# EAGLE design Bluesaab RN52 v5.0 + 10pin (EAGLE 7.6.0)
Removed DFU switch! D3 CANNOT be a Schottky diode; needs to be a signal diode. Might as well make all diodes the same... Added 2 bypass caps to RN52 power line. Switched to SN65HVD234 for higher temp (also has Enable pin which needs pulled high). Added 10 pin connector for the daughter board Amplifier. - OTHERWISE, THE LEFT 4 COLUMNS NEED JUMPERED.
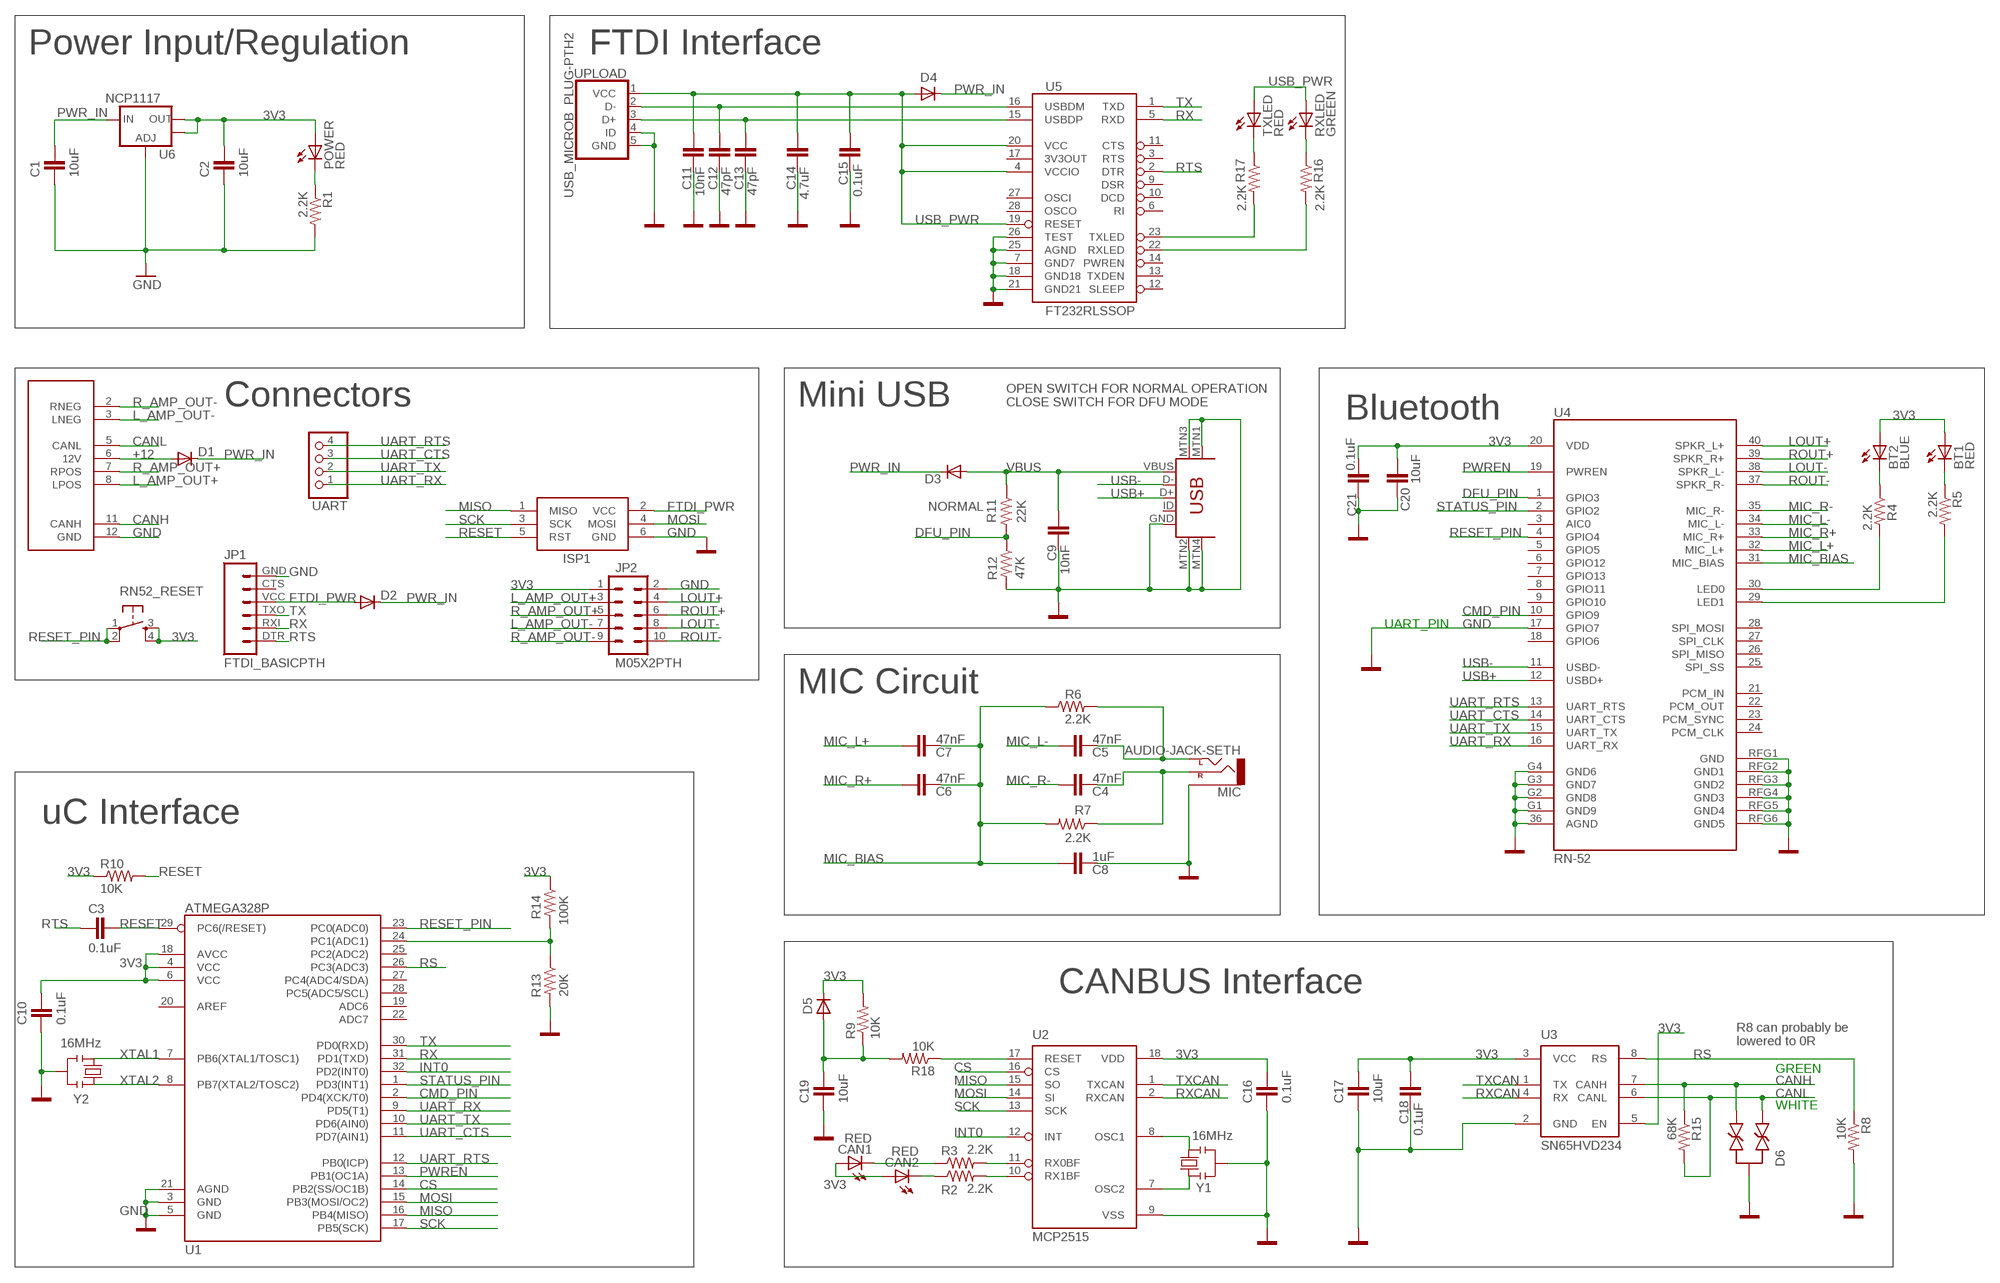
[diagram p0: schematic, sheet 1]

## Parts
BT1  RED  LEDSML1206  [SML1206]
BT2  BLUE  LEDSML1206  [SML1206]
C1  10uF  C-EUC0805K  [C0805K]
C2  10uF  C-EUC0805K  [C0805K]
C3  0.1uF  C-EUC0805K  [C0805K]
C4  47nF  C-EUC0805K  [C0805K]
C5  47nF  C-EUC0805K  [C0805K]
C6  47nF  C-EUC0805K  [C0805K]
C7  47nF  C-EUC0805K  [C0805K]
C8  1uF  C-EUC0805K  [C0805K]
C9  10nF  C-EUC0805K  [C0805K]
C10  0.1uF  C-EUC0805K  [C0805K]
C11  10nF  C-EUC0805K  [C0805K]
C12  47pF  C-EUC0805K  [C0805K]
C13  47pF  C-EUC0805K  [C0805K]
C14  4.7uF  C-EUC0805K  [C0805K]
C15  0.1uF  C-EUC0805K  [C0805K]
C16  0.1uF  C-EUC0805K  [C0805K]
C17  10uF  C-EUC0805K  [C0805K]
C18  0.1uF  C-EUC0805K  [C0805K]
C19  10uF  C-EUC0805K  [C0805K]
C20  10uF  C-EUC0805K  [C0805K]
C21  0.1uF  C-EUC0805K  [C0805K]
CAN1  RED  LEDSML1206  [SML1206]
CAN2  RED  LEDSML1206  [SML1206]
D1  DIODE-SCHOTTKY_  DIODE-SOD123  [SOD123]
D2  DIODE-SCHOTTKY_  DIODE-SOD123  [SOD123]
D3  DIODE-SCHOTTKY_  DIODE-SOD123  [SOD123]
D4  DIODE-SCHOTTKY_  DIODE-SOD123  [SOD123]
D5  DIODE-SCHOTTKY_  DIODE-SOD123  [SOD123]
D6  DIODE-ARRAY  [SOT23]
ISP1  AVRISP-6  [AVRISP]
JP1  FTDI_BASICPTH  [FTDI_BASIC]
JP2  M05X2PTH  [AVR_ICSP]
MIC  AUDIO-JACK-SETH  [AUDIO-JACK-3.5MM-SMD-SETH]
POWER  RED  LEDSML1206  [SML1206]
R1  2.2K  R-US_R0805  [R0805]
R2  2.2K  R-US_R0805  [R0805]
R3  2.2K  R-US_R0805  [R0805]
R4  2.2K  R-US_R0805  [R0805]
R5  2.2K  R-US_R0805  [R0805]
R6  2.2K  R-US_R0805  [R0805]
R7  2.2K  R-US_R0805  [R0805]
R8  10K  R-US_R0805  [R0805]
R9  10K  R-US_R0805  [R0805]
R10  10K  R-US_R0805  [R0805]
R11  22K  R-US_R0805  [R0805]
R12  47K  R-US_R0805  [R0805]
R13  20K  R-US_R0805  [R0805]
R14  100K  R-US_R0805  [R0805]
R15  68K  R-US_R0805  [R0805]
R16  2.2K  R-US_R0805  [R0805]
R17  2.2K  R-US_R0805  [R0805]
R18  10K  R-US_R0805  [R0805]
RN52_FIRMWARE  USB-MINIB-5PIN  [USB-MINIB]
RN52_RESET  TAC_SWITCH  [TACTILE_SWITCH_SMD_6MM]
RXLED  GREEN  LEDSML1206  [SML1206]
TXLED  RED  LEDSML1206  [SML1206]
U1  ATMEGA328P  ATMEGA328_SMT  [TQFP32-08]
U2  MCP2515  [SO18L]
U3  SN65HVD234  [SO8]
U4  RN-52  BLUETOOTH-RN-52  [RN-52]
U5  FT232RLSSOP  [SSOP28DB]
U6  NCP1117  V_REG_LM1117SOT223  [SOT223]
U$5  827229-1  [827229-1]
UART  PINHD-1X4  [1X04]
UPLOAD  USB_MICROB_PLUG-PTH2  [MICRO-B-TH]
Y1  16MHz  RESONATORSMD  [RESONATOR-SMD]
Y2  16MHz  RESONATORSMD  [RESONATOR-SMD]

## Nets
3V3: BT1.A BT2.A C2.2 C10.2 C16.2 C17.2 C18.1 C20.1 C21.2 CAN1.A CAN2.A D5.C JP2.1 POWER.A R9.2 R10.1 R14.1 RN52_RESET.3 RN52_RESET.4 U1.4(VCC) U1.6(VCC) U1.18(AVCC) U2.18(VDD) U3.3(VCC) U3.5(EN) U4.20(VDD) U6.2(OUT) U6.4(OUT)
+12 [12v]: D1.A U$5.6(12V)
CANH: D6.2 R15.1 U3.7(CANH) U$5.11(CANH)
CANL: D6.1 R15.2 U3.6(CANL) U$5.5(CANL)
CMD_PIN: U1.2(PD4(XCK/T0)) U4.10(GPIO9)
CS: U1.14(PB2(SS/OC1B)) U2.16(CS)
DFU_PIN: R11.2 R12.1 U4.1(GPIO3)
FTDI_PWR: D2.A ISP1.2(VCC) JP1.VCC
GND: C1.1 C2.1 C8.1 C9.1 C10.1 C11.1 C12.1 C13.1 C14.1 C15.2 C16.1 C17.1 C18.2 C19.1 C20.2 C21.1 D6.3 ISP1.6(GND) JP1.GND JP2.2 MIC.SLEEVE R1.2 R8.2 R12.2 R13.2 RN52_FIRMWARE.GND RN52_FIRMWARE.MTN1(MTN2) RN52_FIRMWARE.MTN2(MTN3) RN52_FIRMWARE.MTN3(MTN1) RN52_FIRMWARE.MTN4 U1.3(GND) U1.5(GND) U1.21(AGND) U2.9(VSS) U3.2(GND) U4.17(GPIO7) U4.36(AGND) U4.G1(GND9) U4.G2(GND8) U4.G3(GND7) U4.G4(GND6) U4.RFG1(GND) U4.RFG2(GND1) U4.RFG3(GND2) U4.RFG4(GND3) U4.RFG5(GND4) U4.RFG6(GND5) U5.7(GND7) U5.18(GND18) U5.21(GND21) U5.25(AGND) U5.26(TEST) U6.1(ADJ) U$5.12(GND) UPLOAD.4(ID) UPLOAD.5(GND) Y1.2 Y2.2
INT0: U1.32(PD2(INT0)) U2.12(INT)
L_AMP_OUT+: JP2.3 U$5.8(LPOS)
L_AMP_OUT-: JP2.7 U$5.3(LNEG)
LOUT+: JP2.4 U4.40(SPKR_L+)
LOUT-: JP2.8 U4.38(SPKR_L-)
MIC_BIAS: C6.1 C7.1 C8.2 R6.1 R7.2 U4.31(MIC_BIAS)
MIC_L+: C7.2 U4.32(MIC_L+)
MIC_L-: C5.1 U4.34(MIC_L-)
MIC_R+: C6.2 U4.33(MIC_R+)
MIC_R-: C4.1 U4.35(MIC_R-)
MISO: ISP1.1(MISO) U1.16(PB4(MISO)) U2.15(SO)
MOSI: ISP1.4(MOSI) U1.15(PB3(MOSI/OC2)) U2.14(SI)
N$1: R16.2 U5.22(RXLED)
N$4: U2.8(OSC1) Y1.3
N$5: U2.7(OSC2) Y1.1
N$6: BT2.C R4.1
N$7: BT1.C R5.1
N$8: R18.1 U2.17(RESET)
N$9: R13.1 R14.2 U1.24(PC1(ADC1))
N$10: R17.2 U5.23(TXLED)
N$12: R16.1 RXLED.C
N$13: CAN1.C R3.1
N$15: R17.1 TXLED.C
N$16: CAN2.C R2.1
N$17: POWER.C R1.1
N$18: R3.2 U2.11(RX0BF)
N$23: C4.2 MIC.RING(RIGHT) R7.1
N$25: C5.2 MIC.TIP(LEFT) R6.2
N$28: R5.2 U4.29(LED1)
N$29: R4.2 U4.30(LED0)
N$31: R2.2 U2.10(RX1BF)
N$35: C19.2 D5.A R9.1 R18.2
PWR_IN [12v]: C1.2 D1.C D2.C D3.C D4.C U6.3(IN)
PWREN: U1.13(PB1(OC1A)) U4.19(PWREN)
R_AMP_OUT+: JP2.5 U$5.7(RPOS)
R_AMP_OUT-: JP2.9 U$5.2(RNEG)
RESET: C3.2 ISP1.5(RST) R10.2 U1.29(PC6(/RESET))
RESET_PIN: RN52_RESET.1 RN52_RESET.2 U1.23(PC0(ADC0)) U4.4(GPIO4)
ROUT+: JP2.6 U4.39(SPKR_R+)
ROUT-: JP2.10 U4.37(SPKR_R-)
RS: R8.1 U1.26(PC3(ADC3)) U3.8(RS)
RTS: C3.1 JP1.DTR U5.2(DTR)
RX: JP1.RXI U1.31(PD1(TXD)) U5.5(RXD)
RXCAN: U2.2(RXCAN) U3.4(RX)
SCK: ISP1.3(SCK) U1.17(PB5(SCK)) U2.13(SCK)
STATUS_PIN: U1.1(PD3(INT1)) U4.2(GPIO2)
TX: JP1.TXO U1.30(PD0(RXD)) U5.1(TXD)
TXCAN: U2.1(TXCAN) U3.1(TX)
UART_CTS: U1.11(PD7(AIN1)) U4.14(UART_CTS) UART.3
UART_RTS: U1.12(PB0(ICP)) U4.13(UART_RTS) UART.4
UART_RX: U1.9(PD5(T1)) U4.16(UART_RX) UART.1
UART_TX: U1.10(PD6(AIN0)) U4.15(UART_TX) UART.2
USB+: RN52_FIRMWARE.D+ U4.12(USBD+)
USB-: RN52_FIRMWARE.D- U4.11(USBD-)
USB_PWR: C11.2 C14.2 C15.1 D4.A RXLED.A TXLED.A U5.4(VCCIO) U5.19(RESET) U5.20(VCC) UPLOAD.1(VCC)
USBDM: C12.2 U5.16(USBDM) UPLOAD.2(D-)
USBDP: C13.2 U5.15(USBDP) UPLOAD.3(D+)
VBUS: C9.2 D3.A R11.1 RN52_FIRMWARE.VBUS
XTAL1: U1.7(PB6(XTAL1/TOSC1)) Y2.1
XTAL2: U1.8(PB7(XTAL2/TOSC2)) Y2.3
Unconnected: JP1.CTS RN52_FIRMWARE.ID U1.19(ADC6) U1.20(AREF) U1.22(ADC7) U1.25(PC2(ADC2)) U1.27(PC4(ADC4/SDA)) U1.28(PC5(ADC5/SCL)) U4.3(AIC0) U4.5(GPIO5) U4.6(GPIO12) U4.7(GPIO13) U4.8(GPIO11) U4.9(GPIO10) U4.18(GPIO6) U4.21(PCM_IN) U4.22(PCM_OUT) U4.23(PCM_SYNC) U4.24(PCM_CLK) U4.25(SPI_SS) U4.26(SPI_MISO) U4.27(SPI_CLK) U4.28(SPI_MOSI) U5.3(RTS) U5.6(RI) U5.9(DSR) U5.10(DCD) U5.11(CTS) U5.12(SLEEP) U5.13(TXDEN) U5.14(PWREN) U5.17(3V3OUT) U5.27(OSCI) U5.28(OSCO)

## Notes on the sheet
- Power Input/Regulation | FTDI Interface
- Connectors | Mini USB
- OPEN SWITCH FOR NORMAL OPERATION
  CLOSE SWITCH FOR DFU MODE
- Bluetooth
- NORMAL
- UART_PIN
- MIC Circuit
- uC Interface
- CANBUS Interface
- R8 can probably be
  lowered to 0R
- GREEN
- WHITE

## Library data of the parts
BT1 BT2 CAN1 CAN2 POWER RXLED TXLED = led:LED: LED OSRAM: - CHIPLED LG R971, LG N971, LY N971, LG Q971, LY Q971, LO R971, LY R971 LH N974, LH R974 LS Q976, LO Q976, LY Q976 LO Q996 - Hyper CHIPLED LW Q18S LB Q993, LB Q99A, LB R99A - SideLED LS A670, LO A670, LY A670, LG A670, LP A670 LB A673, LV A673, LT A673, LW A673 LH A674 LY A675 LS A676, LA A676, LO A676, LY A676, LW A676 LS A679, LY A679, LG A679 - Hyper Micro SIDELED® LS Y876, LA Y876, LO Y876, LY Y876 LT Y87S - SmartLED LW L88C, LW L88S LB L89C, LB L89S, LG L890 LS L89K, LO L89K, LY L89K LS L896, LA L896, LO L896, LY L896 - TOPLED LS T670, LO T670, LY T670, LG T670, LP T670 LSG T670, LSP T670, LSY T670, LOP T670, LYG T670 LG T671, LOG T671, LSG T671 LB T673, LV T673, LT T673, LW T673 LH T674 LS T676, LA T676, LO T676, LY T676, LB T676, LH T676, LSB T676, LW T676 LB T67C, LV T67C, LT T67C, LS T67K, LO T67K, LY T67K, LW E67C LS E67B, LA E67B, LO E67B, LY E67B, LB E67C, LV E67C, LT E67C LW T67C LS T679, LY T679, LG T679 LS T770, LO T770, LY T770, LG T770, LP T770 LB T773, LV T773, LT T773, LW T773 LH T774 LS E675, LA E675, LY E675, LS T675 LS T776, LA T776, LO T776, LY T776, LB T776 LHGB T686 LT T68C, LB T68C - Hyper Mini TOPLED® LB M676 - Mini TOPLED Santana® LG M470 LS M47K, LO M47K, LY M47K Source: http://www.osram.convergy.de LUXEON: - LUMILED® LXK2-PW12-R00, LXK2-PW12-S00, LXK2-PW14-U00, LXK2-PW14-V00 LXK2-PM12-R00, LXK2-PM12-S00, LXK2-PM14-U00 LXK2-PE12-Q00, LXK2-PE12-R00, LXK2-PE12-S00, LXK2-PE14-T00, LXK2-PE14-U00 LXK2-PB12-K00, LXK2-PB12-L00, LXK2-PB12-M00, LXK2-PB14-N00, LXK2-PB14-P00, LXK2-PB14-Q00 LXK2-PR12-L00, LXK2-PR12-M00, LXK2-PR14-Q00, LXK2-PR14-R00 LXK2-PD12-Q00, LXK2-PD12-R00, LXK2-PD12-S00 LXK2-PH12-R00, LXK2-PH12-S00 LXK2-PL12-P00, LXK2-PL12-Q00, LXK2-PL12-R00 Source: www.luxeon.com KINGBRIGHT: KA-3528ASYC Source: www.kingbright.com
C1-C21 = rcl:C-EU: CAPACITOR, European symbol
D1-D5 = diode_seth:DIODE-: DIODE
D6 = SparkFun-seth:DIODE-ARRAY: NUP2105L, TVS Diode Array
ISP1 = adafruit:AVRISP: AVR ISP HEADER Standard 6 pin header for AVR programming
JP1 = SparkFun-seth:FTDI_BASIC: FTDI Basic: 3.3V and 5V
JP2 = SparkFun-Connectors:M05X2: Header 5x2 Standard 10-pin dual row 0.1" header. Commonly used with AVR-ISP. Use with Spark Fun Electronics SKU: PRT-00778
MIC = SparkFun-Connectors:AUDIO-JACK-SETH
R1-R18 = rcl:R-US_: RESISTOR, American symbol
RN52_FIRMWARE = SparkFun-Connectors:USB-MINIB: Mini-USB "B" connector with 5th pin broken out. Created new symbol breaking out 5th "ID" pin in mini/micro USB connector spec. See: http://en.wikipedia.org/wiki/Mini_usb#Cables. Uses same footprint as 4-pin symbol. Also added pins to connect to mounting / shield pads if required (probably not generally needed as signals aren't shielded once they leave the connector).
RN52_RESET = SparkFun-seth:TAC_SWITCH: Momentary Switch Button commonly used for reset or general input. Spark Fun Electronics SKU : COM-00097
U1 = SparkFun-DigitalIC:ATMEGA328_SMT: 32-Pin Atmega328 part Commonly used on Arduino compatible boards Available in QFP and QFN packages TQFP is IC-09069 QFN is non-stock; PROD_ID: IC-09069
U2 = mcp2515-seth:MCP2515
U3 = ti-can-seth:SN65HVD234
U4 = SparkFun-RF:BLUETOOTH-RN-52
U5 = SparkFun-DigitalIC:FT232RL: USB UART FT232RL 4th Generation USB UART (USB <-> Serial) Controller. Spark Fun Electronics SKU : COM-00650 Production SKU IC-00870; PROD_ID: IC-00870
U6 = SparkFun:V_REG_LM1117: Voltage Regulator LM1117 Standard adjustable voltage regulator but in SMD form. Spark Fun Electronics SKU : COM-00595
U$5 = 827229-1:827229-1
UART = pinhead:PINHD-1X4: PIN HEADER
UPLOAD = SparkFun-Connectors-seth:USB_MICROB_PLUG: USB Micro-B Plug Comes in a variety of packages. Check out Hirose's ZX-x0 line: http://www.hirose.co.jp/cataloge_hp/e24200011.pdf
Y1 Y2 = SparkFun-seth:RESONATOR: Resonator Small SMD resonator. This is the itty bitty 10/20MHz resonators with built in caps. CSTCE10M0G55 and CSTCE20M0V53. Footprint has been reviewed closely but hasn't been tested yet.

## Net classes
0 default: width 0.254 mm
1 12v: width 0.5 mm

## Board
New PCB design, based on v4.4, NOW with 0805 resistors and caps. Adjusted layout to account for smaller parts.
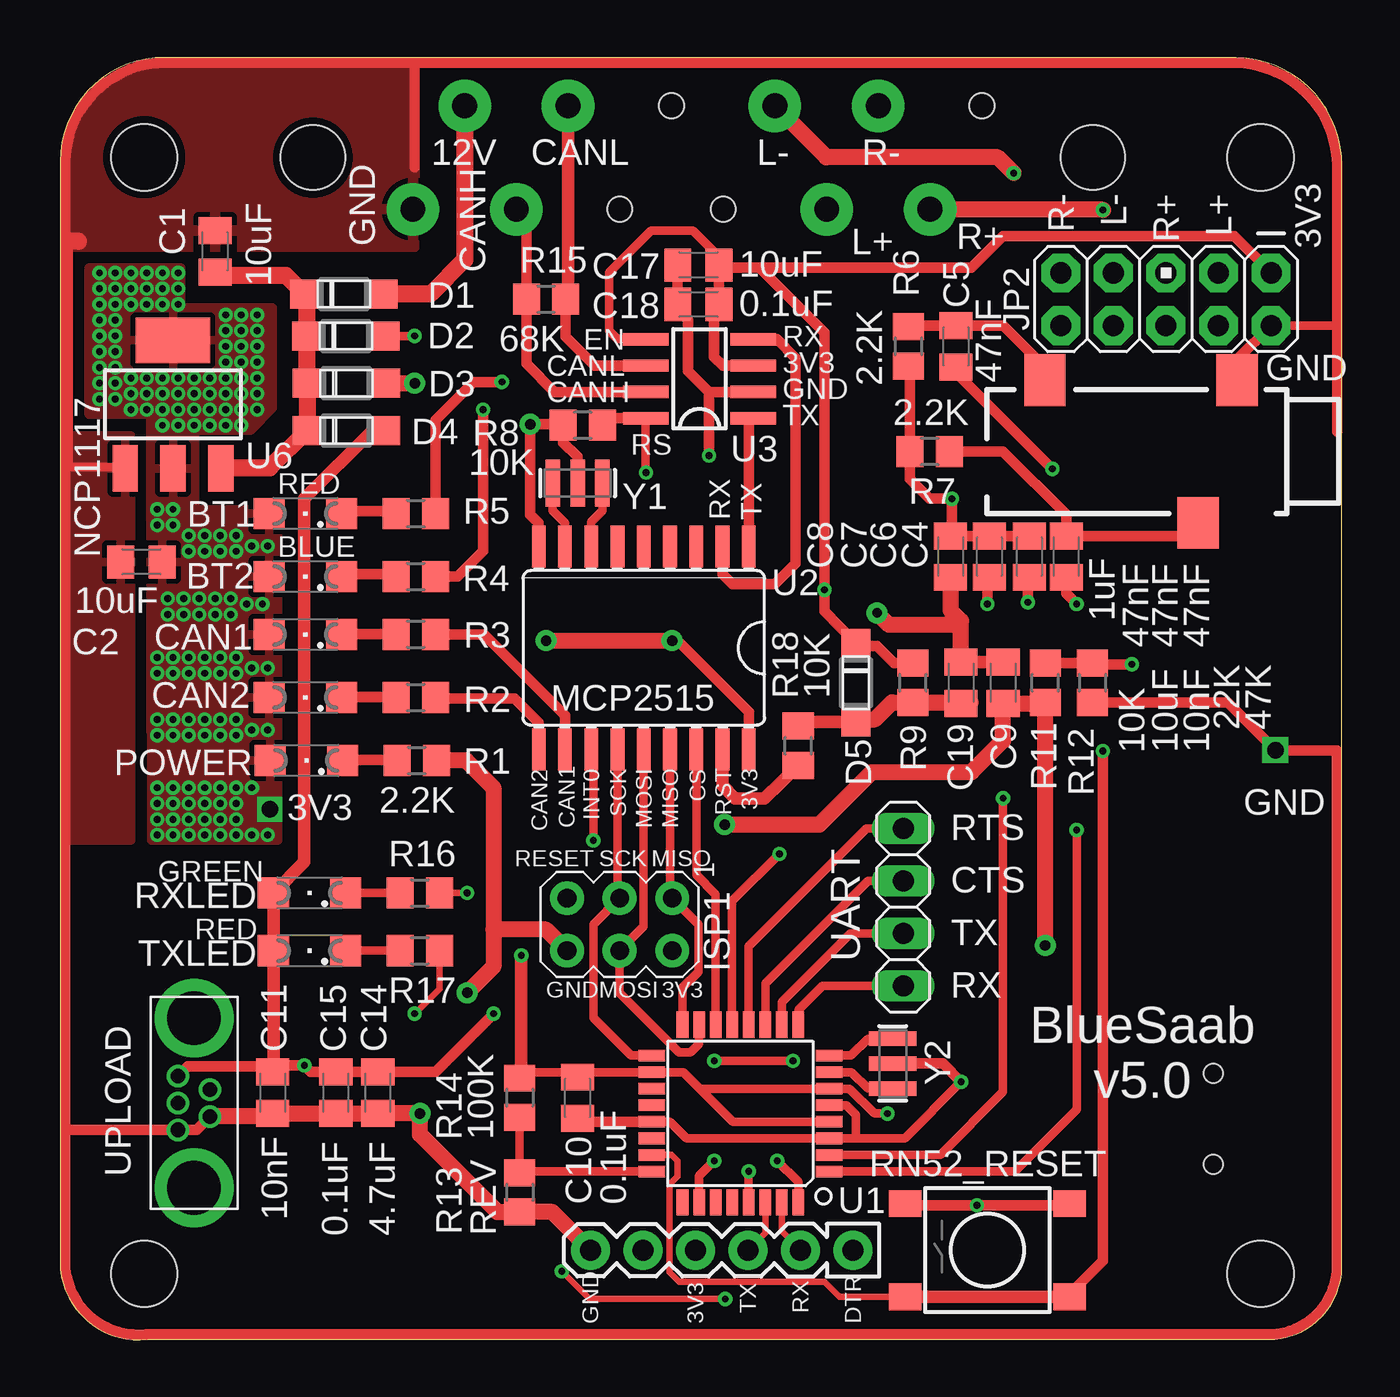
[diagram p1: board, top side]
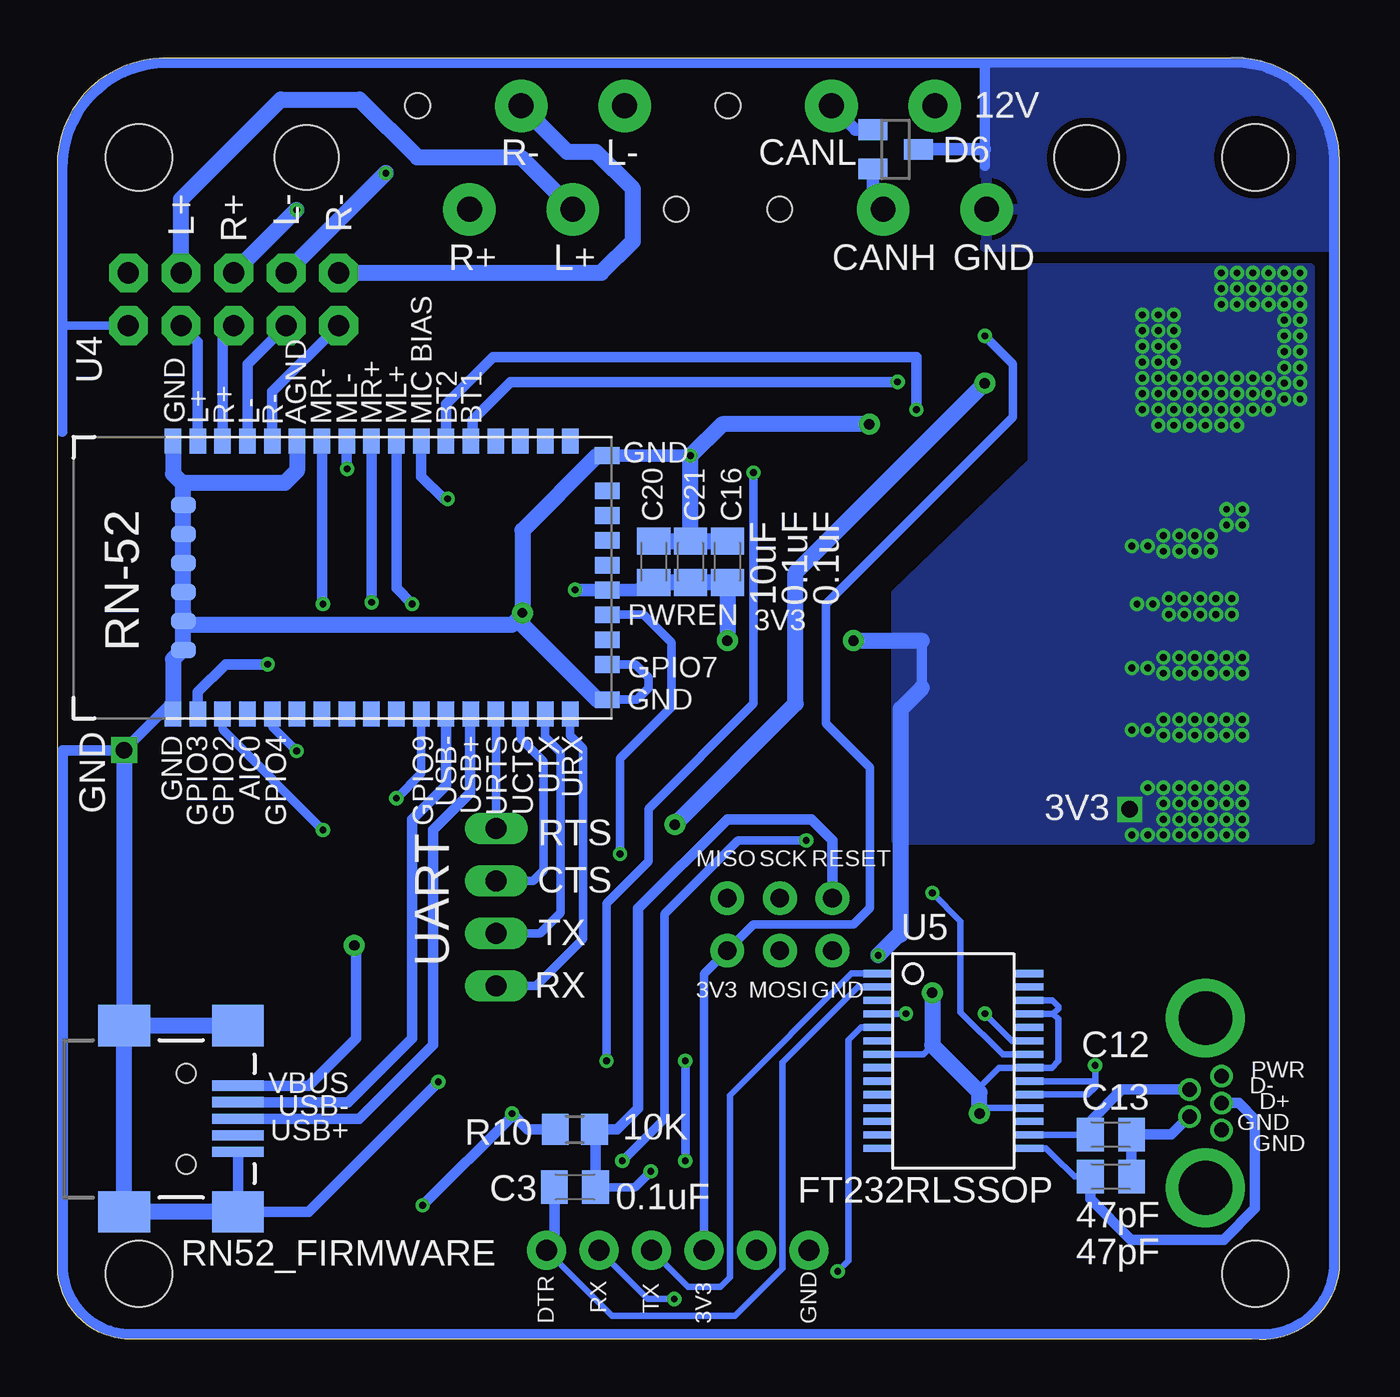
[diagram p2: board, bottom side, seen from below]

Size 61.98 x 62 mm. Coordinates in mm from the lower left corner, seen from the top.
Outline: 56.86,62 5.06,62 arc90 0,56.97 0,3.42 arc90 4.24,0.02 58.4,0.02 arc90 61.98,3.53 61.98,56.71 arc90 56.86,62
Copper layers (1*16): Top 0.0356mm / dielectric 1.5011mm / Bottom 0.0356mm
Design rules "OSHPark": minimum track width 6mil, minimum drill 13mil, track to track 6mil, track to pad 6mil, pad to pad 6mil, via to via 6mil, smd to smd 6mil, copper to edge 15mil, drill to drill 6mil, minimum pad ring 7mil, minimum via ring 7mil, stop-mask expansion 4mil, vias tented up to drill 0mil, thermal gap 10mil
Holes 3.2 mm at 4.06,57.17 58.04,57.17 58.04,3.2 4.06,3.2

### Footprints (pad centres in the part's own frame; a part is rotated, then mirrored left to right if it is on the bottom)
SML1206 = smd 1.5 x 1.5: A 1.75,0; C -1.75,0
C0805K = smd 1.3 x 1.6: 1 -1,0; 2 1,0
SOD123 = smd 1.4 x 1.4: A 1.9,0; C -1.9,0
SOT23 = smd 1 x 1.4: 1 -0.95,-1.1; 2 0.95,-1.1; 3 0,1.1
AVRISP = drill 0.9 pad 1.626: 1 -1.27,2.54; 2 1.27,2.54; 3 -1.27,0; 4 1.27,0; 5 -1.27,-2.54; 6 1.27,-2.54
FTDI_BASIC = drill 1.016 pad 1.88: CTS 10.16,0; DTR 0,0; GND 12.7,0; RXI 2.54,0; TXO 5.08,0; VCC 7.62,0
AVR_ICSP = drill 1.016 pad 1.88 octagon: 1 -1.27,5.08; 2 1.27,5.08; 3 -1.27,2.54; 4 1.27,2.54; 5 -1.27,0; 6 1.27,0; 7 -1.27,-2.54; 8 1.27,-2.54; 9 -1.27,-5.08; 10 1.27,-5.08
AUDIO-JACK-3.5MM-SMD-SETH = smd 2 x 2.5: RING 4.3,3.45; SLEEVE 2.4,-3.45; TIP 11.7,-3.45
R0805 = smd 1.3 x 1.5: 1 -0.95,0; 2 0.95,0
USB-MINIB = smd 2.5 x 0.5: D+ 2.5,0; D- 2.5,0.8; GND 2.5,-1.6; ID 2.5,-0.8; VBUS 2.5,1.6 | smd 2.5 x 2: MTN1 -3,4.5; MTN2 2.5,4.5; MTN3 -3,-4.5; MTN4 2.5,-4.5 | hole 0.9: 0,2.2; 0,-2.2
TACTILE_SWITCH_SMD_6MM = smd 1.55 x 1.3: 1 -3.975,2.25; 2 3.975,2.25; 3 -3.975,-2.25; 4 3.975,-2.25
TQFP32-08 = smd 1.27 x 0.559: 1 -4.293,2.8; 2 -4.293,2; 3 -4.293,1.2; 4 -4.293,0.4; 5 -4.293,-0.4; 6 -4.293,-1.2; 7 -4.293,-2; 8 -4.293,-2.8; 17 4.293,-2.8; 18 4.293,-2; 19 4.293,-1.2; 20 4.293,-0.4; 21 4.293,0.4; 22 4.293,1.2; 23 4.293,2; 24 4.293,2.8 | smd 0.559 x 1.27: 9 -2.8,-4.293; 10 -2,-4.293; 11 -1.2,-4.293; 12 -0.4,-4.293; 13 0.4,-4.293; 14 1.2,-4.293; 15 2,-4.293; 16 2.8,-4.293; 25 2.8,4.293; 26 2,4.293; 27 1.2,4.293; 28 0.4,4.293; 29 -0.4,4.293; 30 -1.2,4.293; 31 -2,4.293; 32 -2.8,4.293
SO18L = smd 0.66 x 2.032: 1 -5.08,-4.902; 2 -3.81,-4.902; 3 -2.54,-4.902; 4 -1.27,-4.902; 5 0,-4.902; 6 1.27,-4.902; 7 2.54,-4.902; 8 3.81,-4.902; 9 5.08,-4.902; 10 5.08,4.902; 11 3.81,4.902; 12 2.54,4.902; 13 1.27,4.902; 14 0,4.902; 15 -1.27,4.902; 16 -2.54,4.902; 17 -3.81,4.902; 18 -5.08,4.902
SO8 = smd 0.6 x 2.2: 1 -1.905,-2.6; 2 -0.635,-2.6; 3 0.635,-2.6; 4 1.905,-2.6; 5 1.905,2.6; 6 0.635,2.6; 7 -0.635,2.6; 8 -1.905,2.6
RN-52 = smd 1.2 x 0.8: 1 -6.6,8.33; 2 -6.6,7.13; 3 -6.6,5.93; 4 -6.6,4.73; 5 -6.6,3.53; 6 -6.6,2.33; 7 -6.6,1.13; 8 -6.6,-0.07; 9 -6.6,-1.27; 10 -6.6,-2.47; 11 -6.6,-3.67; 12 -6.6,-4.87; 13 -6.6,-6.07; 14 -6.6,-7.27; 15 -6.6,-8.47; 16 -6.6,-9.67; 25 6.6,-9.67; 26 6.6,-8.47; 27 6.6,-7.27; 28 6.6,-6.07; 29 6.6,-4.87; 30 6.6,-3.67; 31 6.6,-2.47; 32 6.6,-1.27; 33 6.6,-0.07; 34 6.6,1.13; 35 6.6,2.33; 36 6.6,3.53; 37 6.6,4.73; 38 6.6,5.93; 39 6.6,7.13; 40 6.6,8.33; G1 -6.6,9.53; G4 6.6,9.53 | smd 0.8 x 1.2: 17 -4.2,-11.47; 18 -3,-11.47; 19 -1.8,-11.47; 20 -0.6,-11.47; 21 0.6,-11.47; 22 1.8,-11.47; 23 3,-11.47; 24 4.2,-11.47; G2 -5.9,-11.47; G3 5.9,-11.46; RFG1 -3.5,9.03; RFG2 -2.1,9.03; RFG3 -0.7,9.03; RFG4 0.7,9.03; RFG5 2.1,9.03; RFG6 3.5,9.03
SSOP28DB = smd 0.348 x 1.397: 1 -4.225,-3.656; 2 -3.575,-3.656; 3 -2.925,-3.656; 4 -2.275,-3.656; 5 -1.625,-3.656; 6 -0.975,-3.656; 7 -0.325,-3.656; 8 0.325,-3.656; 9 0.975,-3.656; 10 1.625,-3.656; 11 2.275,-3.656; 12 2.925,-3.656; 13 3.575,-3.656; 14 4.225,-3.656; 15 4.225,3.656; 16 3.575,3.656; 17 2.925,3.656; 18 2.275,3.656; 19 1.625,3.656; 20 0.975,3.656; 21 0.325,3.656; 22 -0.325,3.656; 23 -0.975,3.656; 24 -1.625,3.656; 25 -2.275,3.656; 26 -2.925,3.656; 27 -3.575,3.656; 28 -4.225,3.656
SOT223 = smd 1.219 x 2.235: 1 -2.311,-3.099; 2 0,-3.099; 3 2.311,-3.099 | smd 3.6 x 2.2: 4 0,3.099
827229-1 = drill 1.2 pad 2.54: 2 2.96,-9.495; 3 2.96,-4.495; 5 2.96,5.505; 6 2.96,10.505; 7 -2.04,-11.995; 8 -2.04,-6.995; 11 -2.04,8.005; 12 -2.04,13.005 | hole 3.1: 0.46,17.84; 0.46,-19.86 | hole 1.2: -2.04,3.005; 2.96,-14.495; -2.04,-1.995; 2.96,0.505
1X04 = drill 1.016 long: 1 -3.81,0; 2 -1.27,0; 3 1.27,0; 4 3.81,0
MICRO-B-TH = drill 0.711 pad 1.092: 1 -1.3,-0.775; 2 -0.65,0.775; 3 0,-0.775; 4 0.65,0.775; 5 1.3,-0.775 | drill 2.591 pad 3.81: P$1 -4.1,0; P$2 4.1,0
RESONATOR-SMD = smd 0.7 x 2.286: 1 -1.2,0; 2 0,0; 3 1.2,0

### Placement (x,y rotation side)
BT1  11.86,39.95 180 top
BT2  11.86,36.9 180 top
C1  7.49,52.63 270 top
C2  3.94,37.61 0 top
C3  36.96,7.39 0 bottom
C4  48.64,37.87 90 top
C5  43.31,48.03 90 top
C6  46.86,37.87 270 top
C7  44.93,37.87 270 top
C8  43.05,37.87 90 top
C9  45.59,31.77 270 top
C10  25.02,11.71 90 top
C11  10.29,11.96 90 top
C12  11.05,9.93 180 bottom
C13  11.05,7.9 180 bottom
C14  15.37,11.96 90 top
C15  13.33,11.96 270 top
C16  29.59,37.61 270 bottom
C17  30.86,51.97 0 top
C18  30.86,50.06 180 top
C19  43.56,31.77 270 top
C20  33.15,37.61 90 bottom
C21  31.37,37.61 270 bottom
CAN1  11.86,34.11 180 top
CAN2  11.86,31.06 180 top
D1  13.72,50.57 0 top
D2  13.82,48.54 0 top
D3  13.84,46.25 0 top
D4  13.84,43.96 0 top
D5  38.48,31.77 270 top
D6  21.46,57.55 270 bottom
ISP1  27.05,20.09 270 top
JP1  38.34,4.34 180 top
JP2  53.47,50.31 270 top
MIC  59.31,42.95 180 top
POWER  11.91,28.01 180 top
R1  17.25,28.01 0 top
R2  17.2,31.06 0 top
R3  17.2,34.11 0 top
R4  17.2,36.9 0 top
R5  17.2,39.95 0 top
R6  41.02,48.03 90 top
R7  42.04,42.95 180 top
R8  25.27,44.22 180 top
R9  41.23,31.77 90 top
R10  36.96,10.18 0 bottom
R11  47.62,31.77 90 top
R12  49.91,31.77 270 top
R13  22.23,7.13 270 top
R14  22.23,11.71 270 top
R15  23.5,50.31 0 top
R16  17.4,21.61 0 top
R17  17.4,18.82 0 top
R18  35.69,28.72 90 top
RN52_FIRMWARE  55.75,10.69 0 bottom
RN52_RESET  44.83,4.34 180 top
RXLED  12.06,21.61 180 top
TXLED  12.06,18.82 180 top
U1  32.89,10.94 180 top
U2  28.22,33.45 180 top
U3  30.92,46.47 90 top
U4  46.86,36.85 90 bottom
U5  18.67,13.48 270 bottom
U6  5.46,45.23 0 top
U$5  30.07,56.7 90 top
UART  40.77,20.93 90 top
UPLOAD  6.48,11.45 270 top
Y1  25.02,41.42 180 top
Y2  40.26,13.36 90 top

### Tracks (layer width: path | path; a pad name or v marks a point on that pad's centre or on a via)
3V3  (via drill 0.33, 0.5 pad 1.02, 0.8)
  Top 0.305: v22.3,18.6 22.33,18.56 v22.3,18.59 | 10.13,27.99 POWER.A
  Top 0.406: R14.1 22.3,12.94 24.77,12.94 | 24.77,12.94 U1.18 30.13,12.94 30.93,12.14 | v40,10.94 39.37,10.94 38.17,12.14 U1.6 30.93,12.14 | C10.2 25.02,12.69 24.77,12.94 | U1.4 32.53,10.54 30.93,12.14 | U3.5 26.96,48.37 26.54,48.79 26.54,51.58 28.58,53.62 30.61,53.62 31.86,52.36 C17.2
  Top 0.5: 10.21,31.09 CAN2.A 10.21,30.93 | 10.21,33.98 CAN1.A 10.21,34.29 | 10.21,36.88 BT2.A | 10.21,37.03 BT2.A | 10.24,39.85 BT1.A 9.93,39.85 | 10.24,37.26 BT2.A | 10.21,28.06 POWER.A | U2.18 | 36.96,47.64 36.96,48.69 33.81,51.84 33.4,51.84 31.98,51.84 | U1.18 | U3.3 32.04,47.1 31.62,47.52 31.62,49.83 C18.1 C17.2 | D5.C 38.6,33.55 39.5,33.55
  Top 0.508: 36.96,47.64 v36.96,36.27 36.96,35.23 38.45,33.7 arc-90 D5.C | 39.5,33.55 40.32,32.72 R9.2 | 31.98,51.84 C17.2 | v29.59,33.8 29.85,33.8 33.3,30.35 U2.18 | RN52_RESET.3 arc-90 49.22,6.5 v44.32,6.5 41.45,6.5 RN52_RESET.4 | JP2.1 56.77,53.36 45.59,53.36 44.07,51.84 33.4,51.84
  Top 0.61: CAN1.A 10.06,34.06 | 22.3,12.94 v22.3,18.6
  Top 0.762: 10.24,39.85 10.11,39.73 | 10.21,36.88 10.11,36.78 | 10.21,33.98 10.11,33.88 | 10.21,30.93 10.16,30.89 | 10.07,39.91 arc90 BT1.A | v23.5,33.8 v29.59,33.8
  Top 0.813: 5.41,48.28 U6.4
  Bottom 0.305: 21.21,19.58 21.31,19.58
  Bottom 0.5: 35.56,36.28 U4.20 | v44.32,6.5 40,10.82 v40,10.94
  Bottom 0.508: R10.1 39.24,10.18 v40,10.94 | 20.19,33.8 20.19,31.52
  Bottom 0.61: v36.96,36.27 36.94,36.25 U4.20 34.02,36.25 C20.1
  Bottom 0.762: 21.21,19.58 21.21,30.5 20.19,31.52 | 21.31,19.58 v22.3,18.59 | v23.5,33.8 20.19,33.8 | v29.59,33.8 C16.2 C21.2 C20.1
  other vias: 10.13,25.65 1.91,51.58 2.67,47.77 1.91,50.06 4.19,44.98 5.71,45.74 8.76,47.27 8.76,45.74 2.67,50.82 1.91,48.54 1.91,47.01 2.67,46.25 5.71,44.98 8,44.22 9.52,46.5 9.52,49.55 4.95,51.58 2.67,49.3 4.19,45.74 9.52,44.98 9.52,48.03 3.43,51.58 4.19,50.82 3.43,50.06 4.95,50.06 8,49.55 4.95,44.22 6.48,44.22 8.76,44.22 7.24,46.5 5.46,40.15 4.7,29.99 6.99,29.99 6.73,35.84 5.46,29.23 4.7,40.15 5.46,25.93 2.67,51.58 1.91,50.82 4.19,51.58 3.43,50.82 1.91,49.3 2.67,48.54 1.91,47.77 1.91,46.25 2.67,50.06 2.67,47.01 3.43,45.74 4.95,44.98 4.95,45.74 6.48,44.98 5.71,44.22 7.24,44.22 7.24,45.74 8.76,44.98 9.52,45.74 8.76,46.5 8,47.27 9.52,47.27 8,48.03 8.76,49.55 8.76,48.03 4.19,50.06 4.95,50.82 3.43,46.5 4.95,46.5 5.71,46.5 3.43,44.98 4.19,46.5 6.48,46.5 6.48,45.74 7.24,44.98 8,44.98 8,45.74 8,46.5 8,48.79 8.76,48.79 9.52,48.79 5.71,51.58 5.71,50.82 5.71,50.06 2.67,45.49 1.91,45.49 4.7,39.39 4.7,29.23 6.22,29.99 5.46,26.69 5.46,25.17 6.22,24.41 6.99,24.41 7.75,24.41 8.51,24.41 9.27,24.41 10.03,24.41 4.7,26.69 4.7,25.93 4.7,25.17 4.7,24.41 5.46,24.41 5.46,29.99 6.22,29.23 6.99,29.23 6.22,26.69 6.99,26.69 7.75,26.69 8.51,26.69 9.27,26.69 6.22,25.93 6.99,25.93 7.75,25.93 8.51,25.93 6.22,25.17 6.99,25.17 7.75,25.17 8.51,25.17 5.46,39.39 6.22,38.88 6.22,38.12 6.99,38.12 6.99,38.88 7.75,38.88 7.75,38.12 8.51,38.12 8.51,38.88 9.27,38.38 10.03,38.38 5.21,35.07 5.21,35.84 5.97,35.07 6.73,35.07 5.97,35.84 7.49,35.84 8.25,35.84 7.49,35.07 8.25,35.07 9.02,35.58 9.78,35.58 7.75,29.99 8.51,29.99 7.75,29.23 8.51,29.23 9.27,29.49 10.03,29.49 4.7,32.99 6.99,32.99 5.46,32.23 4.7,32.23 6.22,32.99 5.46,32.99 6.22,32.23 6.99,32.23 7.75,32.99 8.51,32.99 7.75,32.23 8.51,32.23 9.27,32.48 10.03,32.48
  pour Top: 1.4,51.84 1.4,44.73 4.37,44.73 4.39,24.15 10.54,24.15 10.54,40.15 6.53,40.15 6.53,43.96 9.21,43.96 10.29,45.04 10.29,49.91 5.87,49.91 5.87,51.84
  pour Bottom: 1.4,51.84 1.4,24.15 21.46,24.15 21.46,36.09 14.86,42.44 14.86,51.84
+12
  Top 0.813: U$5.6 19.56,52.22 17.91,50.57 D1.A
CANH
  Top 0.508: U$5.11 22.55,54.18 R15.1 22.55,47.2 23.91,45.83 U3.7
  Top 0.61: U$5.11
  Bottom 0.61: D6.2 22.56,55.16 U$5.11
CANL
  Top 0.508: U3.6 25.84,47.1 24.45,48.5 R15.2
  Top 0.61: R15.2 24.56,50.67 U$5.5
  Bottom 0.61: D6.1 23.4,58.5 U$5.5
CMD_PIN  (via drill 0.33)
  Top 0.406: v45.59,26.18 45.59,11.98 42.56,8.94 U1.2
  Bottom 0.406: U4.10 44.39,27.38 v45.59,26.18
  Bottom 0.5: 44.33,30.26 U4.10
CS
  Top 0.406: U2.16 30.76,22.48 31.69,21.54 U1.14
DFU_PIN  (via drill 0.33)
  Top 0.508: R11.2 R12.1 arc90 49.97,32.66 v51.82,32.66
  Bottom 0.5: 55.19,30.81 U4.1
  Bottom 0.508: 55.19,30.81 55.19,31.32 53.85,32.66 v51.82,32.66
FTDI_PWR  (via drill 0.33)
  Top 0.406: v17.14,48.54 D2.A
  Bottom 0.406: v17.14,48.54 15.79,47.19 15.79,44.6 24.3,36.09 24.82,35.58 24.82,29.79 22.71,27.68 22.71,20.87 23.5,20.09 28.32,20.09 ISP1.2 30.72,17.69 JP1.VCC
GND  (via drill 0.33, 0.46 pad 1.02, 0.5 pad 1.02, 0.8 pad 1.27)
  Top 0.406: 37.26,9.67 U1.3 | U1.21 29.48,10.54 30.28,9.74 U1.3 | 0.41,53.14 0.38,53.11 | 0.38,42.19 3.1,42.19 U6.1 | U1.3 38.41,9.74 | 38.41,9.74 38.48,9.81 38.48,10.87 38.01,11.34 U1.5 | 38.41,9.74 40.84,9.74 v43.56,12.47 | JP2.2 61.75,49.04 | 3.68,10.15 3.68,10.18
  Top 0.5: 18.42,28.03 R1.2 | Y2.2 42.67,13.36 v43.56,12.47 | UPLOAD.5 3.68,10.15 0.25,10.15 0.25,9.93 | 58.75,28.5 61.72,28.5 | 0.38,53.11 0.38,42.19 | C10.1 25.1,10.54 U1.21 | C18.2 C17.1 | 31.37,45.83 30.35,46.85 30.35,49.3 | 31.37,45.83 v31.37,42.75 | U3.2 31.37,45.83
  Top 0.508: 61.72,28.5 61.72,3.68 arc-90 58.55,0.28 4.17,0.28 arc-90 0.25,3.43 0.25,9.93 0.25,56.92 arc-90 5.11,61.74 17.14,61.74 | 17.14,61.74 17.14,56.69 | 17.14,61.74 56.52,61.74 arc-90 61.75,56.87 61.75,49.04 61.75,43.91 | UPLOAD.5 6.6,10.15 UPLOAD.4 | 30.35,49.3 29.86,49.79 C18.2 | Y1.2 25.02,42.69 24.32,43.39 R8.2 arc90 24.27,44.27 v22.73,44.27 22.73,39.9 23.14,39.49 U2.9 | R12.2 56.45,30.82 v58.75,28.52 | MIC.SLEEVE 56.91,47.41 JP2.2
  Top 0.61: C19.1 C9.1 | 24.51,44.15 arc-90 R8.2
  Top 0.762: 20.96,19.83 20.96,26.69 19.63,28.01 R1.2 | 20.96,19.83 20.96,18.06 v19.69,16.79 | ISP1.6 23.5,19.83 20.96,19.83 | UPLOAD.4 8.76,10.82 10.14,10.82 C11.1 C15.2 C14.1 17.14,10.96 v17.4,10.94 17.4,9.93 21.14,6.18 R13.2 23.8,6.18 JP1.GND | C19.1 43.56,34.76 | C8.1 43.05,35.27 43.56,34.76 | 43.56,34.76 43.37,34.57 40.08,34.57 v39.5,35.15
  Top 0.813: 0.41,53.14 0.86,53.14 0.89,53.11
  Bottom 0.305: U5.26 13.88,16.41 13.59,16.12 13.59,16.01 13.84,15.76 U5.25 15,15.77 13.84,15.77 13.59,15.52 13.59,13.48 13.91,13.16 U5.21 16.45,13.16 17.53,12.09 | U5.18 17.14,11.21 v17.4,10.94 | U5.7 20.12,13.81 19.69,14.25
  Bottom 0.406: U4.G2 33.97,30.95 33.4,31.52 33.4,32.03 34.03,32.65 U4.17 | JP2.2 61.75,49.04
  Bottom 0.5: 56.24,30.09 U4.G1 | U4.RFG1 55.89,33.41 | 61.72,28.5 58.75,28.5
  Bottom 0.508: RN52_FIRMWARE.GND RN52_FIRMWARE.MTN4 49.84,6.19 v43.56,12.47 | 35.43,30.91 U4.G2 | 17.14,61.74 5.18,61.77 arc90 0.25,57.07 0.25,3.45 arc90 4.04,0.28 58.55,0.28 arc90 61.72,3.71 61.72,28.5 | 17.14,61.74 17.14,57.55 17.14,56.78 | 56.52,61.74 56.77,61.74 arc-90 61.75,56.61 | 61.75,56.61 61.75,56.87 arc90 56.52,61.74 | 61.75,56.61 61.75,49.04 61.75,43.91 | 17.14,61.74 56.52,61.74 | C13.1 C12.1 8.13,9.93 UPLOAD.4 | U4.G1 56.39,30.69 56.26,30.82 56.45,30.82 v58.75,28.52
  Bottom 0.61: D6.3 17.14,57.55 | v31.37,42.75 U4.G3 35.88,42.75
  Bottom 0.762: v58.75,28.52 58.75,28.5 RN52_FIRMWARE.MTN1 | RN52_FIRMWARE.MTN2 RN52_FIRMWARE.MTN1 | RN52_FIRMWARE.MTN1 RN52_FIRMWARE.MTN3 RN52_FIRMWARE.MTN4 | v39.5,35.15 39.5,35.07 40,34.57 55.75,34.57 55.89,35.15 | 55.89,35.15 U4.RFG2 55.89,33.41 56.39,32.91 U4.G1 | U4.G4 56.39,41.87 55.95,41.42 55.75,41.42 | U4.36 50.39,42.02 50.98,41.42 55.75,41.42 | U4.G2 35.88,30.95 39.5,34.57 v39.5,35.15 | 55.89,35.15 U4.RFG3 U4.RFG4 U4.RFG5 U4.RFG6 55.89,41.28 55.75,41.42 | 35.88,42.75 39.5,39.14 v39.5,35.15 | v19.69,16.79 19.69,14.25 17.53,12.09 17.4,11.96 v17.4,10.94 | v22.73,44.27 29.84,44.27 v31.37,42.75 C21.1 | C20.2 C21.1 | C21.1 C16.1
  pour Top: 17.14,52.85 17.14,61.74 5.46,61.74 arc90 0.25,56.92 0.25,52.85
  pour Bottom: 17.14,52.85 17.14,61.74 5.46,61.74 arc90 0.25,56.92 0.25,52.85
  pour Top: 0.25,43.71 3.43,43.71 3.43,24.15 0.25,24.15
INT0  (via drill 0.33)
  Top 0.406: U1.32 35.69,7.64 v34.67,8.66 | v25.78,24.15 25.78,28.45 U2.12
  Bottom 0.406: v34.67,8.66 32.64,10.69 32.64,20.6 29.08,24.15 v25.78,24.15
L_AMP_OUT+
  Bottom 0.762: JP2.3 56.01,55.14 51.18,59.97 47.37,59.97 44.58,57.17 39.57,57.17 U$5.8
L_AMP_OUT-  (via drill 0.33)
  Top 0.762: v46.1,56.41 45.34,57.17 37.05,57.17 U$5.3
  Bottom 0.762: JP2.7 v46.1,56.41
LOUT+
  Bottom 0.508: U4.40 55.19,48.23 JP2.4
LOUT-
  Bottom 0.508: U4.38 52.79,47.18 JP2.8
MIC_BIAS  (via drill 0.33)
  Top 0.5: C7.1 C6.1
  Top 0.508: 43.07,38.87 C7.1 | 42.67,38.87 C8.2 43.07,38.87 | R6.1 41.09,47.01 R7.2 41.09,41.61 42.04,40.66 v43.12,40.66 43.12,39.07 43.07,38.87
  Bottom 0.508: v43.12,40.66 43.31,40.66 44.39,41.75 U4.31
MIC_L+  (via drill 0.33)
  Top 0.508: C7.2 44.83,36.85 v44.83,35.58
  Bottom 0.5: U4.32 45.59,36.34 v44.83,35.58
MIC_L-  (via drill 0.33)
  Top 0.508: v47.98,42.11 47.88,42.19 43.31,46.76 C5.1
  Bottom 0.508: v47.98,42.11 47.99,42.07 U4.34
MIC_R+  (via drill 0.33)
  Top 0.508: C6.2 arc90 46.79,36.79 v46.79,35.66
  Bottom 0.5: U4.33 v46.79,35.66
MIC_R-  (via drill 0.33)
  Top 0.508: C4.1 48.64,36.09 v49.15,35.58
  Bottom 0.508: v49.15,35.58 49.19,35.63 U4.35
MISO
  Top 0.406: U2.15 29.49,21.46 ISP1.1 30.86,20.09 30.86,17.8 30.09,17.03 U1.16
MOSI
  Top 0.406: U2.14 28.22,19.99 ISP1.4 27.05,16.79 29.93,13.91 30.48,13.91 30.89,14.32 U1.15
N$1  (via drill 0.33)
  Top 0.305: v19.69,21.61 R16.2
  Bottom 0.305: U5.22 16.28,13.81 18.31,15.84 18.31,20.24 v19.69,21.61
N$4
  Top 0.406: Y1.3 23.82,40.08 24.41,39.49 U2.8
N$5
  Top 0.406: U2.7 25.68,39.54 26.22,40.08 Y1.1
N$6
  Top 0.5: BT2.C 13.72,37.03 15.7,37.03 R4.1
N$7
  Top 0.5: BT1.C 13.72,40.08 15.7,40.08 R5.1
N$8
  Top 0.61: R18.1 34.06,26.18 32.64,26.18 32.03,26.79 U2.17
N$9
  Top 0.305: R13.1 22.29,8.15 22.73,8.15
  Top 0.406: R14.2 R13.1 | U1.24 27.57,8.14 22.73,8.15
N$10  (via drill 0.33)
  Top 0.305: R17.2 18.35,16.97 v17.14,15.77
  Bottom 0.305: U5.23 15.83,14.46 v17.14,15.77
N$12
  Top 0.406: RXLED.C R16.1
N$13
  Top 0.5: CAN1.C 13.72,34.13 15.7,34.13 R3.1
N$15
  Top 0.406: TXLED.C R17.1
N$16
  Top 0.5: CAN2.C 13.72,31.09 15.7,31.09 R2.1
N$17
  Top 0.5: POWER.C 13.72,28.04 15.7,28.04 R1.1
N$18
  Top 0.5: R3.2 20.49,34.11 24.41,30.19 U2.11
N$23
  Top 0.508: R7.1 45.59,42.95 48.64,39.9 C4.2 54.38,38.87 arc90 MIC.RING
N$25
  Top 0.508: R6.2 41.07,49.03 C5.2 45.61,49.03 47.12,47.52 47.12,46.89 MIC.TIP
N$28  (via drill 0.33)
  Top 0.508: v21.36,46.31 19.99,46.31 18.15,44.47 R5.2
  Bottom 0.5: 40.07,46.31 41.91,44.47 41.91,43.58 U4.29
  Bottom 0.508: v21.36,46.31 40.07,46.31
N$29  (via drill 0.33)
  Top 0.5: 18.73,36.92 R4.2
  Top 0.508: v20.45,44.98 20.45,38.13 19.22,36.9 R4.2
  Bottom 0.5: 43.18,45.25 43.18,43.58 U4.30
  Bottom 0.508: v20.45,44.98 20.45,47.52 40.91,47.52 43.18,45.25
N$31
  Top 0.5: 20.6,31.01 18.62,31.01 R2.2
  Top 0.508: 20.6,31.01 21.97,31.01 23.14,29.84 U2.10
N$35
  Top 0.5: 35.89,29.84 35.86,29.87 | D5.A 38.48,29.99
  Top 0.61: R18.2 35.89,29.84 | 35.86,29.87 D5.A
  Top 0.762: 38.48,29.99 39.39,29.99 40.22,30.82 R9.1 44.02,30.82 C19.2
PWR_IN
  Top 0.813: U6.3 7.75,42.16 10.14,42.16 D4.C D3.C 11.92,46.28 D2.C 11.92,50.44 10.92,51.45 | 10.92,51.45 D1.C | 10.92,51.45 8,51.45 C1.2
PWREN  (via drill 0.33)
  Top 0.406: U1.13 32.49,21.21 v34.78,23.5
  Bottom 0.406: U4.19 35.37,35.07 33.65,35.07 32.28,33.7 32.28,30.6 34.78,28.11 v34.78,23.5
R_AMP_OUT+  (via drill 0.33)
  Top 0.762: v50.42,54.63 42.09,54.63 U$5.7
  Bottom 0.762: JP2.5 v50.42,54.63
R_AMP_OUT-
  Bottom 0.762: JP2.9 35.69,51.58 34.16,53.11 34.16,55.65 35.94,57.43 37.32,57.43 U$5.2
RESET  (via drill 0.33)
  Top 0.406: U1.29 v33.29,8.15
  Bottom 0.406: C3.2 34.05,7.39 v33.29,8.15
  Bottom 0.5: ISP1.5 24.51,24.15 25.53,25.17 29.59,25.17 33.91,20.85 33.91,11.71
  Bottom 0.508: 33.91,11.71 33.91,11.2 34.92,10.18 R10.2 35.96,10.13 C3.2
RESET_PIN  (via drill 0.33)
  Top 0.305: U1.23 29.56,8.94 29.85,8.66 29.85,7.9 29.46,7.52 29.46,3.27 29.92,2.82 36.96,2.82 37.68,2.09 RN52_RESET.2
  Top 0.508: v50.42,28.47 50.42,3.83 48.68,2.09
  Top 0.61: RN52_RESET.2 48.68,2.09 RN52_RESET.1
  Bottom 0.406: U4.4 51.59,29.64 v50.42,28.47
ROUT+
  Bottom 0.508: U4.39 53.99,48.52 JP2.6
ROUT-
  Bottom 0.508: U4.37 51.59,45.84 JP2.10
RS  (via drill 0.33)
  Top 0.406: U1.26 30.89,7.93 v31.62,8.66 | v31.62,13.48 v35.43,13.48 | v28.32,41.93 v28.32,41.94 U3.8
  Top 0.508: 26.53,44.56 U3.8
  Top 0.61: 26.53,44.56 26.53,44.27 arc-90 R8.1
  Bottom 0.406: v31.62,8.66 v31.62,13.48 | v35.43,13.48 35.43,21.1 33.4,23.14 33.4,25.68 28.32,30.76 v28.32,41.93
RTS
  Bottom 0.305: JP1.DTR 35.17,1.17 29.22,1.17 26.92,3.47 26.92,13.41 23.28,17.06 U5.2
  Bottom 0.508: C3.1 37.96,4.72 JP1.DTR
RX  (via drill 0.33)
  Top 0.305: U1.31 34.89,5.25 JP1.RXI | v24.26,3.32 25.6,1.98 v32.16,1.98
  Bottom 0.305: U5.5 23.14,15.11 23.75,14.5 23.75,3.83 v24.26,3.32 | JP1.RXI 33.44,1.98 v32.16,1.98
RXCAN
  Top 0.5: 35.56,47.47 35.56,37.54 34.56,36.55 32.5,36.55 32.03,37.02 U2.2 | U3.4 34.66,48.37
  Top 0.508: 34.66,48.37 35.56,47.47
SCK
  Top 0.406: U1.17 27.61,13.74 25.78,15.57 25.78,20.09 ISP1.3 26.95,21.46 U2.13
STATUS_PIN  (via drill 0.33)
  Top 0.406: U1.1 46.15,8.15 49.15,11.15 v49.15,24.66
  Bottom 0.406: v49.15,24.66 53.99,29.5 U4.2
TX
  Top 0.305: U1.30 34.09,5.17 JP1.TXO
  Bottom 0.305: JP1.TXO 31.48,2.56 29.92,2.56 29.46,3.02 29.46,11.83 23.59,17.71 U5.1
TXCAN
  Top 0.5: 33.3,44.56 U2.1
  Top 0.508: 33.3,44.56 U3.1
UART_CTS
  Top 0.406: 34.16,15.31 U1.11 34.09,17.24 39.05,22.2 UART.3
  Bottom 0.406: U4.14 39.59,29.07 38.48,27.96 38.48,22.7 38.99,22.2 UART.3
UART_RTS
  Top 0.406: U1.12 33.29,19.04 38.99,24.74 UART.4
  Bottom 0.406: U4.13 40.77,30.23 UART.4
UART_RX
  Top 0.406: U1.9 35.69,15.94 36.86,17.12 UART.1
  Bottom 0.406: U4.16 37.19,29.21 36.57,28.6 36.57,19.39 38.84,17.12 UART.1
UART_TX
  Top 0.406: 34.92,15.27 U1.10 34.89,16.33 38.22,19.66 UART.2
  Bottom 0.406: U4.15 38.39,29.14 37.65,28.4 37.65,20.65 38.64,19.66 UART.2
USB+
  Bottom 0.508: U4.12 42.03,30.25 42.04,30.25 42.04,26.44 43.81,24.66 43.81,14.27 47.39,10.69 RN52_FIRMWARE.D+
USB-
  Bottom 0.508: U4.11 43.19,26.81 44.83,25.17 44.83,14.58 47.92,11.49 RN52_FIRMWARE.D-
USB_PWR  (via drill 0.33)
  Top 0.5: UPLOAD.1 6.18,13.23 10.29,13.23 10.31,13.26
  Top 0.508: 5.65,12.7 UPLOAD.1 | v20.96,15.77 18.14,12.96 C14.2 | 12.83,13.27 12.83,13.23 13.06,13.23 C15.1 C14.2 | 10.56,13.23 C11.2 10.6,13.27 v11.81,13.27 12.12,12.96 C14.2
  Top 0.61: 10.31,13.26 TXLED.A RXLED.A 11.81,23.11 11.81,40.66 15.11,43.96 D4.A
  Top 0.762: C11.2 10.29,13.23
  Bottom 0.305: v20.96,15.77 22.31,15.77 U5.4 | U5.19 12.17,11.86 11.81,12.21 11.81,12.47 | 11.81,12.47 v11.81,13.27 | U5.20 11.85,12.51 arc90 11.81,12.47
USBDM
  Bottom 0.305: U5.16 12.06,9.91
  Bottom 0.508: UPLOAD.2 10.52,12.1 12.05,10.57 C12.2 12.06,9.91
USBDP
  Bottom 0.305: C13.2 12.83,7.9 13.84,8.91 14.19,9.26 U5.15
  Bottom 0.508: UPLOAD.3 4.87,11.45 4.08,10.67 4.08,6.36 5.59,4.85 10.08,4.85 12.05,6.82 C13.2
VBUS  (via drill 0.5 pad 1.02)
  Top 0.406: 47.59,19.03 v47.62,19.07
  Top 0.762: v47.62,19.07 R11.1 47.32,30.77 C9.2 45.59,28.98 44.07,27.45 39.24,27.45 36.7,24.91 v32.13,24.91 | D3.A v17.14,46.25
  Bottom 0.508: v47.62,19.07 47.55,19.15 47.55,14.57 49.82,12.29 RN52_FIRMWARE.VBUS
  Bottom 0.762: v32.13,24.91 26.29,30.76 26.29,37.11 v17.14,46.25
XTAL1
  Top 0.406: U1.7 38.26,12.94 39.05,12.16 Y2.1
XTAL2
  Top 0.406: U1.8 38.23,13.74 39.05,14.56 Y2.3

### Text on the board
bPlace: RTS | CTS | TX | RX | UART
tNames: 12V | CANL | L- | R- | R- | L- | R+ | L+ | 3V3 | GND | L+ | R+ | CANH | EN | RX | CANL | 3V3 | GND | CANH | GND | TX | RS | RX | TX | CAN2 | CAN1 | INT0 | SCK | MOSI | MISO | CS | RST | 3V3 | GND | 3V3 | RTS | RESET | SCK | MISO | CTS | TX | GND | MOSI | 3V3 | RX | BlueSaab / v5.0 | REV | TX | RX | GND | 3V3 | DTR
bNames: 12V | CANL | L- | R- | R- | L- | R+ | L+ | GND | CANH | L+ | R+ | BT1 | BT2 | ML+ | MR+ | ML- | MR- | AGND | L- | R+ | L+ | GND | MIC BIAS | R- | GND | 3V3 | PWREN | GPIO7 | GND | GND | URX | UTX | UCTS | URTS | USB+ | USB- | GPIO9 | GPIO4 | AIC0 | GPIO2 | GPIO3 | GND | 3V3 | RESET | SCK | MISO | GND | MOSI | 3V3 | PWR | D- | VBUS | D+ | USB- | GND | USB+ | GND | TX | RX | GND | 3V3 | DTR